# EAGLE design Isolator1 (EAGLE 9.6.2)
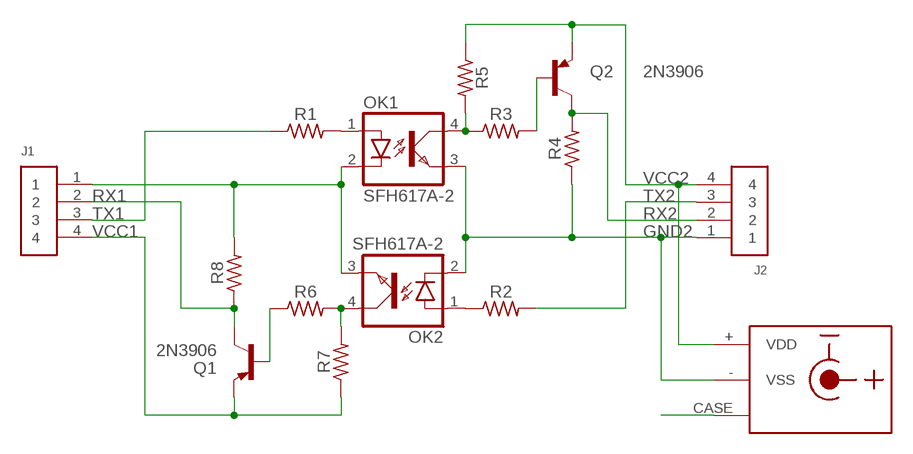
[diagram p0: schematic, sheet 1]

## Parts
J1  61300411121  [61300411121]
J2  61300411121  [61300411121]
OK1  SFH617A-2  SFH618A-2  [DIP4]
OK2  SFH617A-2  SFH618A-2  [DIP4]
Q1  2N3906  BC557C  [TO92-EBC]
Q2  2N3906  BC557C  [TO92-EBC]
R1  200  R-US_0207/7  [0207/7]
R2  200  R-US_0207/7  [0207/7]
R3  1500  R-US_0207/7  [0207/7]
R4  1000  R-US_0207/7  [0207/7]
R5  75  R-US_0207/7  [0207/7]
R6  1500  R-US_0207/7  [0207/7]
R7  75  R-US_0207/7  [0207/7]
R8  1000  R-US_0207/7  [0207/7]
U$1  CUI_PJ-102A  [CUI_DCJACK_PCB]

## Nets
CASE: U$1.CASE
GND1: J1.1 OK1.2(C) OK2.3(EMIT) R8.2
GND2: J2.1 OK1.3(EMIT) OK2.2(C) R4.1 U$1.-(VSS)
N$1: OK2.1(A) R2.1
N$2: OK1.4(COL) R3.1 R5.2
N$3: Q2.B R3.2
N$4: OK1.1(A) R1.2
N$6: OK2.4(COL) R6.2 R7.2
N$7: Q1.B R6.1
RX1: J1.2 Q1.C R8.1
RX2: J2.2 Q2.C R4.2
TX1: J1.3 R1.1
TX2: J2.3 R2.2
VCC1: J1.4 Q1.E R7.1
VCC2: J2.4 Q2.E R5.1 U$1.+(VDD)

## Library data of the parts
J1 J2 = Headers:61300411121: CONN HEADER VERT 4POS 2.54MM Manufacturer's datasheet <https://katalog.we-online.de/em/datasheet/6130xx11121.pdf>; CREATED_BY: PCBLayout.com; DIGI_KEY_PART_NUMBER: 732-5317-ND; MANUFACTURER: Wurth Electronics Inc.; MPN: 61300411121
OK1 OK2 = SamacSys_Parts:SFH618?*: Optocoupler, Phototransistor Output, Low Input Current Source: Data sheet <http://www.vishay.com/docs/83673/sfh618.pdf>; MF: VISHAY/TELEFUNKEN; MPN: SFH618A-2; OC_FARNELL: 6424855; OC_NEWARK: 21H7744
Q1 Q2 = transistor-pnp:BC557*: PNP Transistror
R1-R8 = resistor:R-US_: RESISTOR, American symbol
U$1 = con-dc-jack:CUI_PJ-102A

## Board
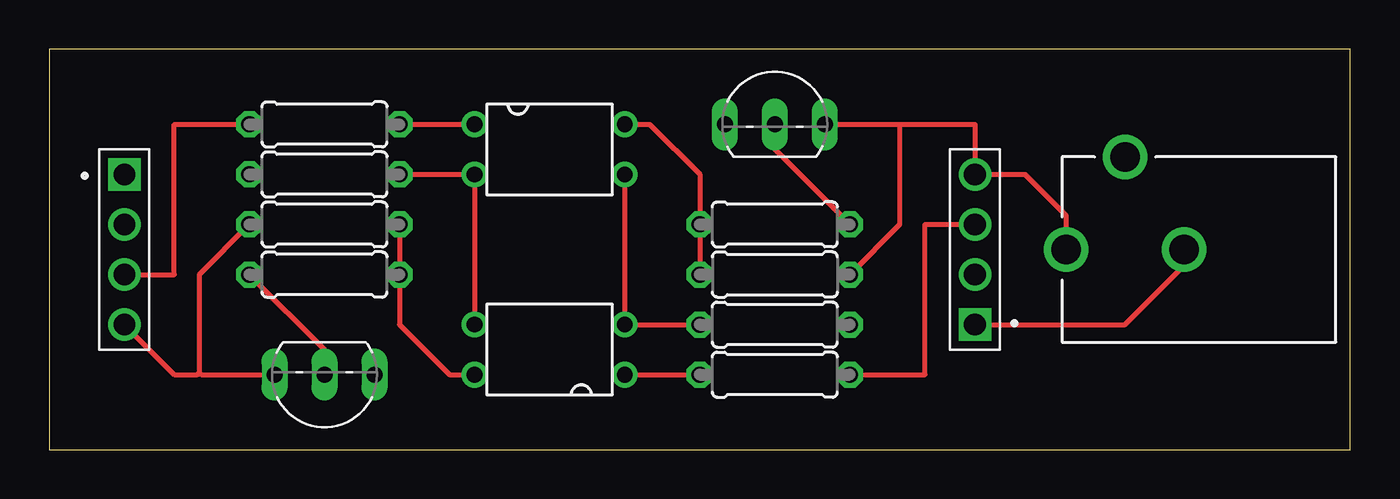
[diagram p1: board, top side]
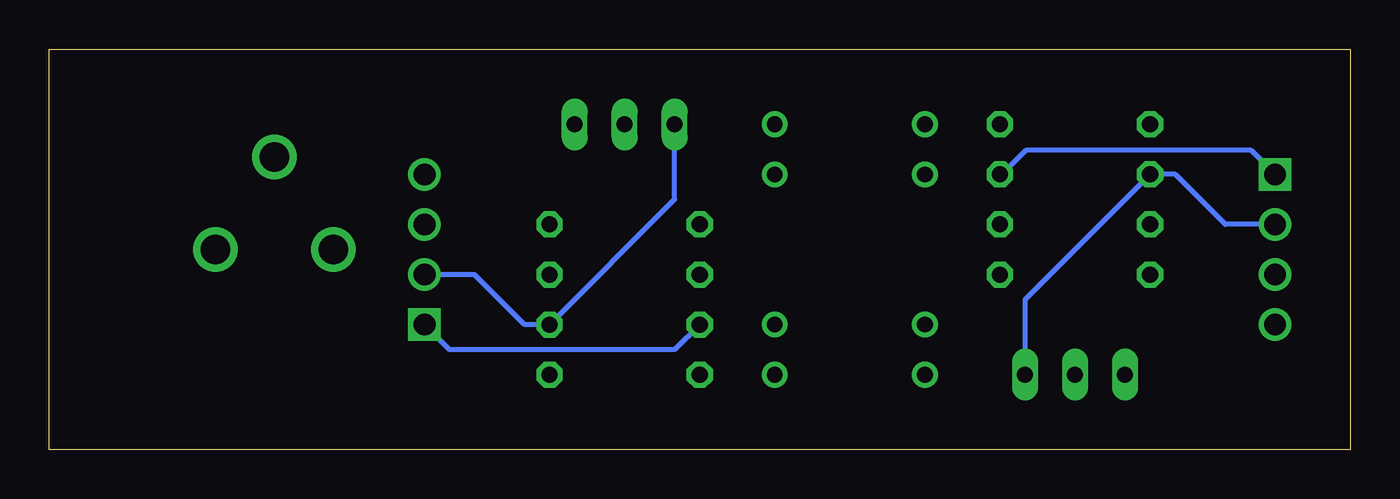
[diagram p2: board, bottom side, seen from below]

Size 66.04 x 20.32 mm. Coordinates in mm from the lower left corner, seen from the top.
Outline: 0,0 66.04,0 66.04,20.32 0,20.32 0,0
Copper layers (1*16): Top 0.035mm / dielectric 1.5mm / Bottom 0.035mm
Design rules "default": minimum track width 6mil, minimum drill 0.35mm, track to track 6mil, track to pad 6mil, pad to pad 6mil, via to via 6mil, smd to smd 6mil, copper to edge 40mil, drill to drill 6mil, minimum pad ring 10mil, minimum via ring 8mil, stop-mask expansion 4mil, vias tented up to drill 0mil, thermal gap 10mil

### Footprints (pad centres in the part's own frame; a part is rotated, then mirrored left to right if it is on the bottom)
61300411121 = drill 1.1 square: 1 -3.81,0 | drill 1.1: 2 -1.27,0; 3 1.27,0; 4 3.81,0
DIP4 = drill 0.8: 1 -1.27,-3.81; 2 1.27,-3.81; 3 1.27,3.81; 4 -1.27,3.81
TO92-EBC = drill 0.813 long: B 0,-1.27; C -2.54,-1.27; E 2.54,-1.27
0207/7 = drill 0.813 octagon: 1 -3.81,0; 2 3.81,0
CUI_DCJACK_PCB = drill 1.5: + -3,0; - 3,0; CASE 0,4.7

### Placement (x,y rotation side)
J1  3.81,10.16 270 top
J2  46.99,10.16 90 top
OK1  25.4,15.24 270 top
OK2  25.4,5.08 90 top
Q1  13.97,2.54 180 top
Q2  36.83,17.78 0 top
R1  13.97,16.51 0 top
R2  36.83,3.81 0 top
R3  36.83,11.43 0 top
R4  36.83,6.35 0 top
R5  36.83,8.89 180 top
R6  13.97,8.89 0 top
R7  13.97,11.43 0 top
R8  13.97,13.97 0 top
U$1  54.61,10.16 0 top

### Tracks (layer width: path | path; a pad name or v marks a point on that pad's centre or on a via)
GND1
  Top 0.254: R8.2 OK1.2 OK2.3
  Bottom 0.254: R8.2 17.68,13.97 16.46,15.19 5.03,15.19 J1.1
GND2
  Top 0.254: J2.1 54.61,6.35 57.61,9.35 U$1.- | R4.1 OK2.2 OK1.3
  Bottom 0.254: R4.1 34.29,5.08 45.72,5.08 J2.1
N$1
  Top 0.254: OK2.1 R2.1
N$2
  Top 0.254: 29.72,16.51 OK1.4 30.48,16.51 33.02,13.97 R3.1 R5.2
N$3
  Top 0.254: R3.2 36.83,15.24 Q2.B
N$4
  Top 0.254: R1.2 OK1.1
N$6
  Top 0.254: OK2.4 20.32,3.81 17.78,6.35 R6.2 R7.2
N$7
  Top 0.254: R6.1 13.97,5.08 Q1.B
RX1
  Top 0.254: 10.21,13.97 R8.1
  Bottom 0.254: 10.06,13.97 R8.1 | J1.2 6.35,11.43 8.89,13.97 R8.1 | R8.1 16.51,7.62 Q1.C
RX2
  Bottom 0.254: Q2.C 34.29,16.46 34.29,12.7 R4.2 41.91,6.35 44.45,8.89 J2.2
TX1
  Top 0.254: J1.3 6.35,8.89 6.35,16.51 R1.1
TX2
  Top 0.254: J2.3 44.45,11.43 44.45,3.81 R2.2
VCC1
  Top 0.254: R7.1 7.62,8.89 7.62,3.91 | J1.4 6.35,3.81 7.52,3.81 7.62,3.91 | 7.62,3.91 7.72,3.81 Q1.E
VCC2
  Top 0.254: 43.18,16.51 46.99,16.51 J2.4 49.53,13.97 51.61,11.89 U$1.+ | R5.1 43.18,11.43 43.18,16.51 | Q2.E 43.18,16.51

### Text on the board
tDocu: Vcc2 5V | Gnd1 | Rx1 | Vcc2 | Tx1 | Tx2 | Vcc1 | Rx2 | Gnd2 | Serial Opto-isolator v1.0 5V/5V
bDocu: chuck@whitmer.us | Serial Opto-isolator v1.0 5V/5V | Copyright (c) 2022 Whitmer Consulting LLC